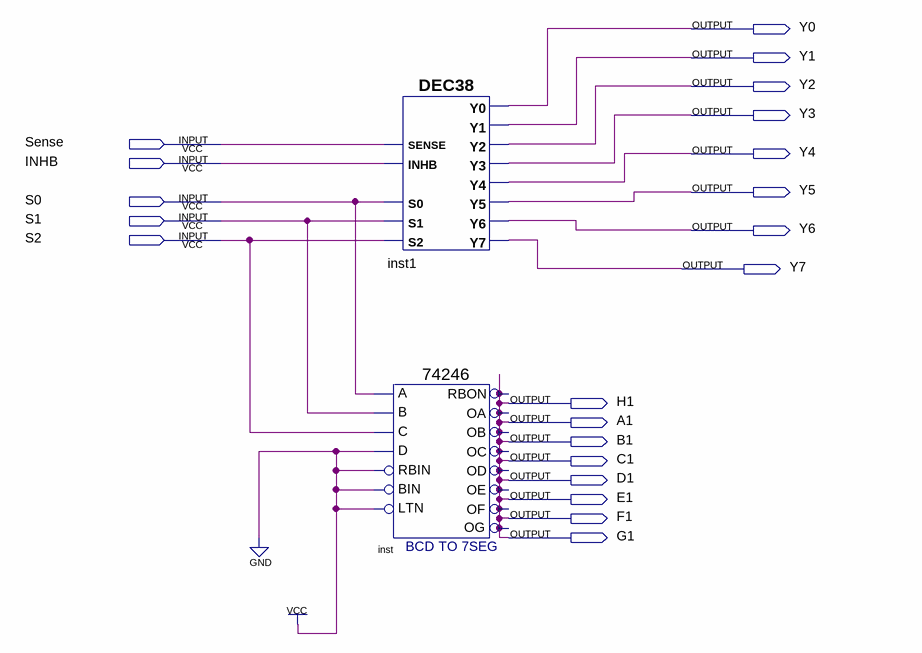
[diagram p0: schematic sheet]
// Quartus schematic cmb.bdf as structural Verilog: 2 symbols, 21 pins
module cmb (
  input  Sense,
  input  INHB,
  input  S0,
  input  S1,
  input  S2,
  output Y0,
  output Y1,
  output Y2,
  output Y3,
  output Y4,
  output Y5,
  output Y6,
  output Y7,
  output H1,
  output A1,
  output B1,
  output C1,
  output D1,
  output E1,
  output F1,
  output G1
);

  DEC38 inst1 (
    .S2(S2), .S1(S1), .INHB(INHB), .S0(S0), .SENSE(Sense), .Y7(Y7), .Y6(Y6), .Y5(Y5), .Y3(Y3), .Y4(Y4),
    .Y0(Y0), .Y1(Y1), .Y2(Y2));
  \74246  inst (
    .B(S1), .A(S0), .RBIN(1'b1), .D(1'b1), .C(S2), .LTN(1'b1), .BIN(1'b1), .OD(A1), .RBON(A1), .OC(A1),
    .OB(A1), .OE(A1), .OF(A1), .OA(A1), .OG(A1));

  assign B1 = A1;
  assign C1 = A1;
  assign D1 = A1;
  assign E1 = A1;
  assign F1 = A1;
  assign G1 = A1;
  assign H1 = A1;
endmodule
